# EAGLE design mother_card_13 (EAGLE 8.3.2)
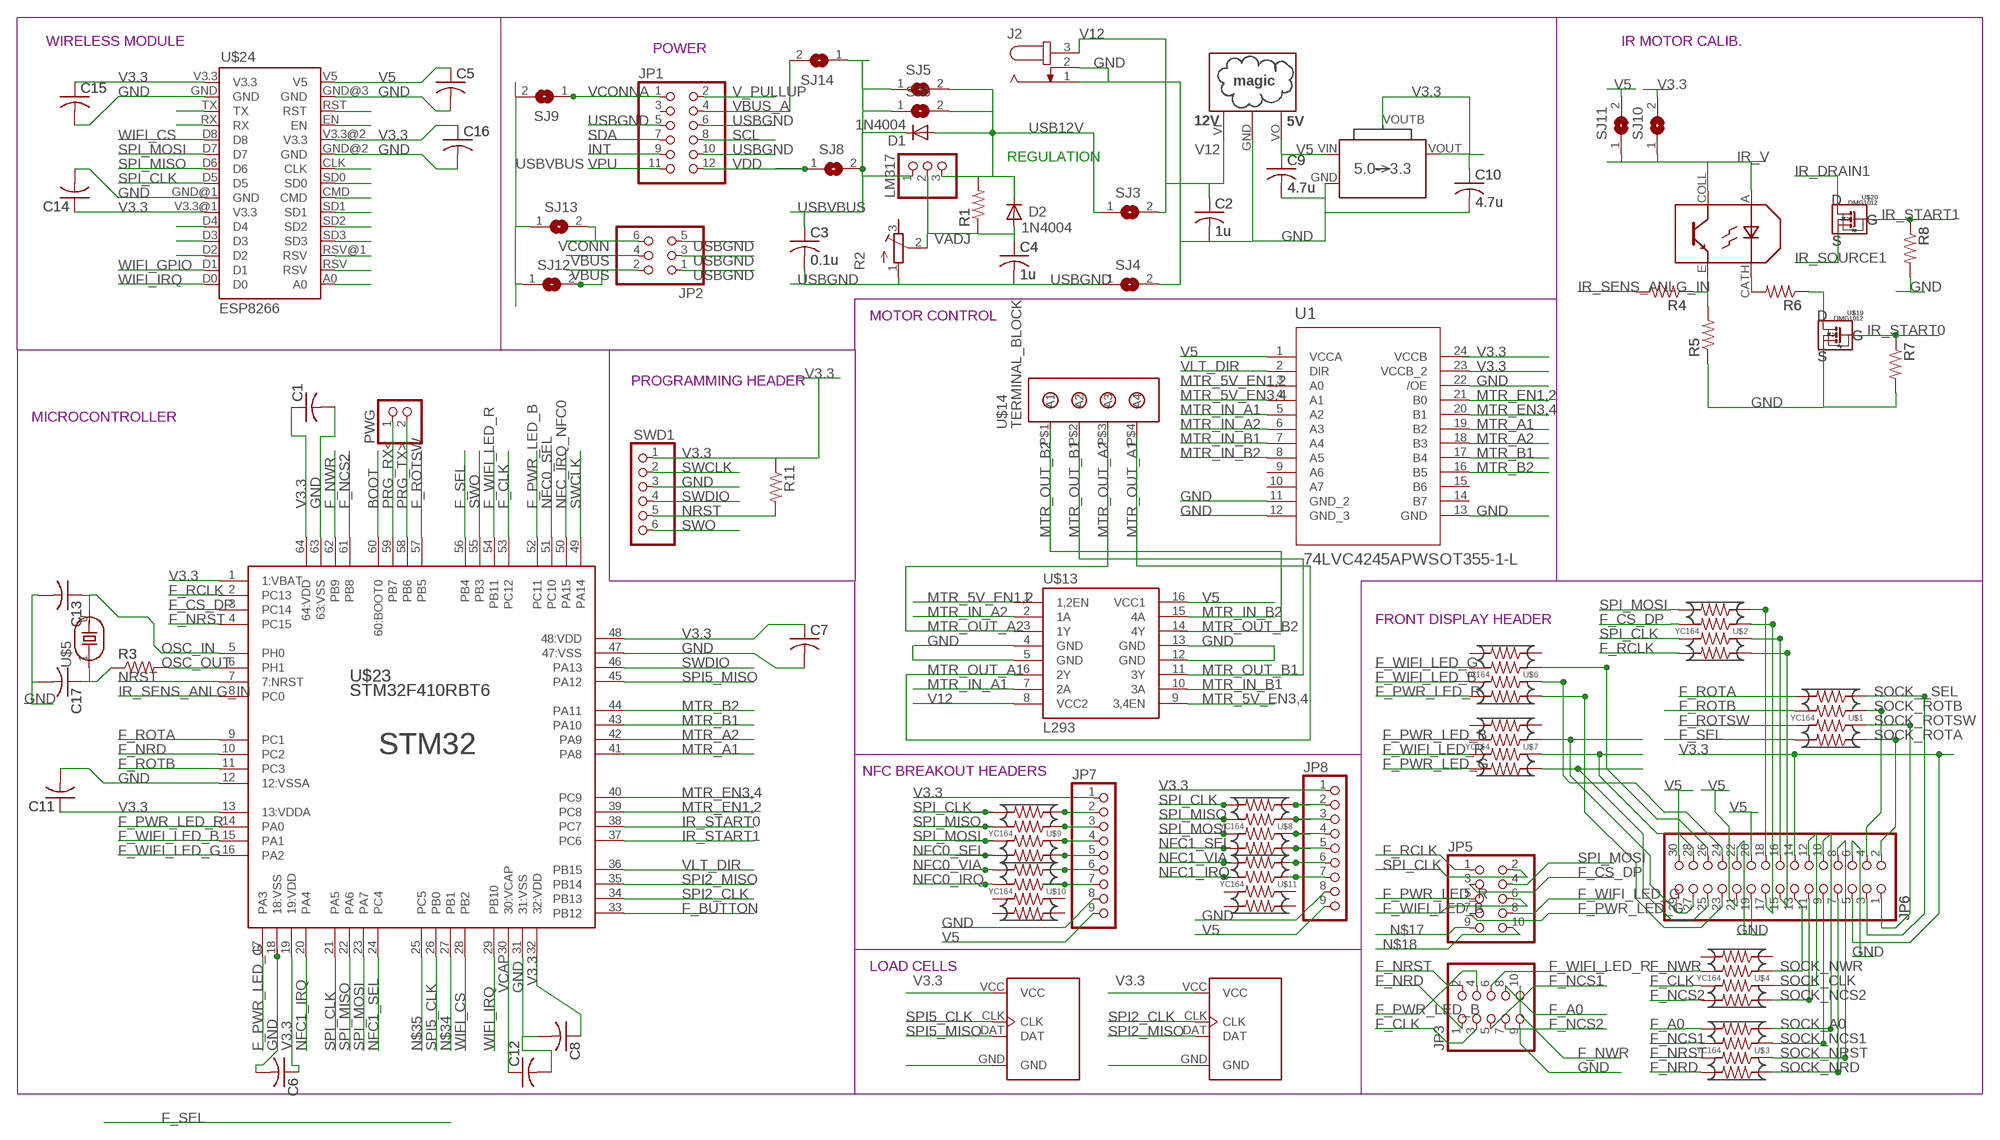
[diagram p0: schematic, sheet 1]

## Parts
C1  C-USC0805  [C0805]
C2  1u  C-USC0805  [C0805]
C3  0.1u  C-USC0805  [C0805]
C4  1u  C-USC0805  [C0805]
C5  C-USC0805  [C0805]
C6  C-USC0805  [C0805]
C7  C-USC0805  [C0805]
C8  C-USC0805  [C0805]
C9  4.7u  C-USC0805  [C0805]
C10  4.7u  C-USC0805  [C0805]
C11  C-USC0805  [C0805]
C12  C-USC0805  [C0805]
C13  C-USC0603  [C0603]
C14  C-USC0805  [C0805]
C15  C-USC0805  [C0805]
C16  C-USC0805  [C0805]
C17  C-USC0603  [C0603]
D1  1N4004  [DO41-10]
D2  1N4004  [DO41-10]
J2  JACK-PLUG0  [SPC4077]
JP1  PINHD-2X6  [2X06]
JP2  PINHD-2X3  [2X03]
JP3  PINHD-2X5  [2X05]
JP5  PINHD-2X5  [2X05]
JP6  PINHD-2X15/SOCK  [2X15/SOCK]
JP7  PINHD-1X9/90  [1X09/90]
JP8  PINHD-1X9/90  [1X09/90]
LM317  PINHD-1X3  [1X03]
PWG  PINHD-1X2  [1X02]
R1  R-US_R0805  [R0805]
R2  R-TRIMM64W  [RTRIM64W]
R3  R-US_R0805  [R0805]
R4  R-US_R0805  [R0805]
R5  R-US_R0805  [R0805]
R6  R-US_R0805  [R0805]
R7  R-US_R0805  [R0805]
R8  R-US_R0805  [R0805]
R11  R-US_R0805  [R0805]
SJ3  SJ  [SJ]
SJ4  SJ  [SJ]
SJ5  SJ  [SJ]
SJ6  SJ  [SJ]
SJ8  SJ  [SJ]
SJ9  SJ  [SJ]
SJ10  SJ  [SJ]
SJ11  SJ  [SJ]
SJ12  SJ  [SJ]
SJ13  SJ  [SJ]
SJ14  SJ  [SJ]
SWD1  PINHD-1X6  [1X06]
U1  74LVC4245APWSOT355-1-L  [SOT355-1-L]
U$1  YC164  [YC164]
U$2  YC164  [YC164]
U$3  YC164  [YC164]
U$4  YC164  [YC164]
U$5  HC-49S_9B  [HC-49S_9B]
U$6  YC164  [YC164]
U$7  YC164  [YC164]
U$8  YC164  [YC164]
U$9  YC164  [YC164]
U$10  YC164  [YC164]
U$11  YC164  [YC164]
U$13  L293  [DIL16]
U$14  TERMINAL_BLOCK  [1X4/BLOCK]
U$15  AP2114H  [AP2114H]
U$16  OKI-78SR-W36  [SIP3]
U$18  TCRT5000  [TCRT5000]
U$19  DMG1012  [SOT323]
U$20  DMG1012  [SOT323]
U$21  HX711  [HX711]
U$22  HX711  [HX711]
U$23  STM32F410RBT6  [QFP50P1200X1200X160-64N]
U$24  ESP8266  [ESP8266]

## Nets
BOOT: U$23.60(60:BOOT0)
F_A0: JP3.8 U$3.P$4
F_BUTTON: U$23.33(PB12)
F_CLK: JP3.3 U$4.P$2 U$23.53(PC12)
F_CS_DP: JP5.3 U$2.P$3 U$23.3(PC14)
F_NCS1: JP3.5 U$3.P$3
F_NCS2: JP3.7 U$4.P$1 U$23.61(PB8)
F_NRD: JP3.1 U$3.P$1 U$23.10(PC2)
F_NRST: JP3.2 U$3.P$2 U$23.4(PC15)
F_NWR: JP3.10 U$4.P$3 U$23.62(PB9)
F_PWR_LED_B: JP3.4 U$7.P$3 U$23.52(PC11)
F_PWR_LED_G: JP5.7 U$7.P$1 U$23.17(PA3)
F_PWR_LED_R: JP5.5 U$6.P$1 U$23.14(PA0)
F_RCLK: JP5.1 U$2.P$1 U$23.2(PC13)
F_ROTA: U$1.P$4 U$23.9(PC1)
F_ROTB: U$1.P$3 U$23.11(PC3)
F_ROTSW: U$1.P$2 U$23.57(PB5)
F_SEL: U$1.P$1 U$23.56(PB4)
F_WIFI_LED_B: JP5.6 U$6.P$2 U$23.15(PA1)
F_WIFI_LED_G: JP5.8 U$6.P$3 U$23.16(PA2)
F_WIFI_LED_R: JP3.6 U$7.P$2 U$23.54(PB11)
GND: C1.2 C2.2 C5.2 C6.2 C7.2 C8.2 C9.2 C10.2 C11.2 C12.2 C13.2 C14.2 C15.2 C16.2 C17.2 J2.1 J2.2 JP3.9 JP6.6 JP6.19 JP6.22 JP7.8 JP8.8 R5.1 R7.2 R8.2 SJ4.2 SWD1.3 U1.11(GND_2) U1.12(GND_3) U1.13(GND) U1.22(/OE) U$13.4(GND) U$13.5(GND) U$13.12(GND) U$13.13(GND) U$15.GND U$16.GND U$19.S U$21.GND U$22.GND U$23.12(12:VSSA) U$23.18(18:VSS) U$23.31(31:VSS) U$23.47(47:VSS) U$23.63(63:VSS) U$24.GND U$24.GND@1(GND) U$24.GND@2(GND) U$24.GND@3(GND)
INT: JP1.9
IR_DRAIN1: U$20.D
IR_SENS_ANLG_IN: R4.2 U$23.8(PC0)
IR_SOURCE1: U$20.S
IR_START0: R7.1 U$19.G U$23.38(PC7)
IR_START1: R8.1 U$20.G U$23.37(PC6)
IR_V: SJ10.1 SJ11.1 U$18.A U$18.COLL
MTR_5V_EN1,2: U1.3(A0) U$13.1(1,2EN)
MTR_5V_EN3,4: U1.4(A1) U$13.9(3,4EN)
MTR_A1: U1.19(B2) U$23.41(PA8)
MTR_A2: U1.18(B3) U$23.42(PA9)
MTR_B1: U1.17(B4) U$23.43(PA10)
MTR_B2: U1.16(B5) U$23.44(PA11)
MTR_EN1,2: U1.21(B0) U$23.39(PC8)
MTR_EN3,4: U1.20(B1) U$23.40(PC9)
MTR_IN_A1: U1.5(A2) U$13.7(2A)
MTR_IN_A2: U1.6(A3) U$13.2(1A)
MTR_IN_B1: U1.7(A4) U$13.10(3A)
MTR_IN_B2: U1.8(A5) U$13.15(4A)
MTR_OUT_A1: U$13.6(2Y) U$14.P$4(A4)
MTR_OUT_A2: U$13.3(1Y) U$14.P$3(A3)
MTR_OUT_B1: U$13.11(3Y) U$14.P$2(A2)
MTR_OUT_B2: U$13.14(4Y) U$14.P$1(A1)
N$1: U$24.A0
N$2: JP7.6 U$10.P$44
N$4: JP8.6 U$11.P$44
N$5: R6.2 U$18.CATH
N$8: R3.2 U$23.6(PH1)
N$9: U$24.RSV
N$10: R6.1 U$19.D
N$13: U$24.RSV@1(RSV)
N$14: U$24.SD3
N$15: U$24.SD2
N$16: U$24.SD1
N$17: JP5.9
N$18: JP5.10
N$23: U$24.CMD
N$24: U$24.SD0
N$25: U$24.CLK
N$26: U$24.D2
N$27: U$24.D3
N$28: U$24.D4
N$29: U$24.RX
N$30: U$24.TX
N$31: U$24.EN
N$32: U$24.RST
N$33: JP8.2 U$8.P$44
N$34: U$23.27(PB1)
N$35: U$23.25(PC5)
N$36: JP8.3 U$8.P$33
N$37: JP8.4 U$8.P$22
N$38: JP8.5 U$8.P$11
N$39: JP8.7 U$11.P$33
N$40: JP7.5 U$9.P$11
N$41: JP7.4 U$9.P$22
N$42: JP7.3 U$9.P$33
N$43: JP7.2 U$9.P$44
N$44: JP7.7 U$10.P$33
N$45: R4.1 R5.2 U$18.E
NFC0_IRQ: U$10.P$3
NFC0_SEL: U$9.P$1 U$23.51(PC10)
NFC0_VIA: U$10.P$4
NFC1_IRQ: U$11.P$3 U$23.20(PA4)
NFC1_SEL: U$8.P$1 U$23.24(PC4)
NFC1_VIA: U$11.P$4
NFC_IRQ_NFC0: U$23.50(PA15)
NRST: R11.2 SWD1.5 U$23.7(7:NRST)
OSC_IN: C13.1 U$5.0 U$23.5(PH0)
OSC_OUT: C17.1 R3.1 U$5.1
PRG_RX<: PWG.1 U$23.59(PB7)
PRG_TX>: PWG.2 U$23.58(PB6)
SCL: JP1.8
SDA: JP1.7
SOCK__CS_DP: JP6.17 U$2.P$33
SOCK__RCLK: JP6.15 U$2.P$11
SOCK__SEL: JP6.3 U$1.P$44
SOCK_A0: JP6.10 U$3.P$44
SOCK_CLK: JP6.12 U$4.P$22
SOCK_NCS1: JP6.9 U$3.P$33
SOCK_NCS2: JP6.11 U$4.P$11
SOCK_NRD: JP6.7 U$3.P$11
SOCK_NRST: JP6.8 U$3.P$22
SOCK_NWR: JP6.13 U$4.P$33
SOCK_PWR_LED_B: JP6.27 U$7.P$33
SOCK_PWR_LED_G: JP6.25 U$7.P$11
SOCK_PWR_LED_R: JP6.23 U$6.P$11
SOCK_ROTA: JP6.2 U$1.P$11
SOCK_ROTB: JP6.4 U$1.P$33
SOCK_ROTSW: JP6.1 U$1.P$22
SOCK_SPI_CLK: JP6.16 U$2.P$22
SOCK_SPI_MOSI: JP6.18 U$2.P$44
SOCK_WIFI_LED_B: JP6.24 U$6.P$22
SOCK_WIFI_LED_G: JP6.26 U$6.P$33
SOCK_WIFI_LED_R: JP6.28 U$7.P$22
SPI2_CLK: U$22.CLK U$23.34(PB13)
SPI2_MISO: U$22.DAT U$23.35(PB14)
SPI5_CLK: U$21.CLK U$23.26(PB0)
SPI5_MISO: U$21.DAT U$23.45(PA12)
SPI_CLK: JP5.2 U$2.P$2 U$8.P$4 U$9.P$4 U$23.21(PA5) U$24.D5
SPI_MISO: U$8.P$3 U$9.P$3 U$23.22(PA6) U$24.D6
SPI_MOSI: JP5.4 U$2.P$4 U$8.P$2 U$9.P$2 U$23.23(PA7) U$24.D7
SWCLK: SWD1.2 U$23.49(PA14)
SWDIO: SWD1.4 U$23.46(PA13)
SWO: SWD1.6 U$23.55(PB3)
USB12V: D1.A D2.C LM317.3 R1.2 SJ3.1 SJ5.2 SJ6.2
USBGND: C3.2 C4.2 JP1.5 JP1.6 JP1.10 JP2.1 JP2.3 JP2.5 R2.1(A) SJ4.1
USBVBUS: C3.1 D1.C LM317.1 SJ5.1 SJ6.1 SJ8.2 SJ9.2 SJ12.1 SJ13.1 SJ14.1
V3.3: C1.1 C6.1 C7.1 C8.1 C10.1 C11.1 C14.1 C15.1 C16.1 JP6.5 JP6.14 JP7.1 JP8.1 R11.1 SJ10.2 SWD1.1 U1.23(VCCB_2) U1.24(VCCB) U$15.VOUT(VO) U$15.VOUTB(BODY) U$21.VCC U$22.VCC U$23.1(1:VBAT) U$23.13(13:VDDA) U$23.19(19:VDD) U$23.32(32:VDD) U$23.48(48:VDD) U$23.64(64:VDD) U$24.V3.3 U$24.V3.3@1(V3.3) U$24.V3.3@2(V3.3)
V5: C5.1 C9.1 JP6.20 JP6.21 JP6.30 JP7.9 JP8.9 SJ11.2 U1.1(VCCA) U$13.16(VCC1) U$15.VIN(VI) U$16.VO U$24.V5
V12: C2.1 J2.3 SJ3.2 U$13.8(VCC2) U$16.VI
V_PULLUP: JP1.2
VADJ: C4.1 D2.A LM317.2 R1.1 R2.2(S)
VBUS: JP2.2 JP2.4 SJ12.2
VBUS_A: JP1.4 SJ14.2
VCAP: C12.1 U$23.30(30:VCAP)
VCONN: JP2.6 SJ13.2
VCONNA: JP1.1 SJ9.1
VDD: JP1.12 SJ8.1
VLT_DIR: U1.2(DIR) U$23.36(PB15)
VPU: JP1.11
WIFI_CS: U$23.28(PB2) U$24.D8
WIFI_GPIO: U$24.D1
WIFI_IRQ: U$23.29(PB10) U$24.D0
Unconnected: JP1.3 JP6.29 R2.3(E) U1.9(A6) U1.10(A7) U1.14(B7) U1.15(B6) U$4.P$4 U$4.P$44 U$6.P$4 U$6.P$44 U$7.P$4 U$7.P$44 U$10.P$1 U$10.P$2 U$10.P$11 U$10.P$22 U$11.P$1 U$11.P$2 U$11.P$11 U$11.P$22

## Notes on the sheet
- WIRELESS MODULE | IR MOTOR CALIB.
- POWER
- REGULATION
- MOTOR CONTROL
- PROGRAMMING HEADER
- MICROCONTROLLER
- FRONT DISPLAY HEADER
- NFC BREAKOUT HEADERS
- LOAD CELLS

## Library data of the parts
C1-C17 = seniorDesign:C-US: CAPACITOR, American symbol
D1 D2 = diode:1N4004: DIODE general purpose rectifier, 1 A
J2 = con-jack:JACK-PLUG: DC POWER JACK Power Jack, DC, Right Angle, Through Hole, Rated 5A at 16VDC, PC Terminals Distributor: Farnell (www.Farnell.de) Drawing: 84N1161.pdf / 84N1162.pdf Manufacturer: SPC Technology (www.spctechnology.com) Type: SPC4077 / SPC 4078; OC_FARNELL: unknown; OC_NEWARK: unknown
JP1 = pinhead:PINHD-2X6: PIN HEADER
JP2 = pinhead:PINHD-2X3: PIN HEADER
JP3 JP5 = pinhead:PINHD-2X5: PIN HEADER
JP6 = seniorDesign:PINHD-2X15: PIN HEADER, socket for parallel cable, IDC connector, On Shore Technology Inc.
JP7 JP8 = pinhead:PINHD-1X9: PIN HEADER
LM317 = pinhead:PINHD-1X3: PIN HEADER
PWG = pinhead:PINHD-1X2: PIN HEADER
R1 R3-R8 = seniorDesign:R-US_: RESISTOR, American symbol
R2 = rcl:R-TRIMM: Trimm resistor
R11 = resistor:R-US_: RESISTOR, American symbol
SJ3-SJ6 SJ8-SJ14 = jumper:SJ: SMD solder JUMPER
SWD1 = pinhead:PINHD-1X6: PIN HEADER
U1 = seniorDesign:74LVC4245APW: Level Translator input board; MANUFACTURER_PART_NUMBER: 74LVC4245APW; VENDOR: NXP
U$1-U$4 U$6-U$11 = seniorDesign:YC164: Yageo Resistor Array motherboard serial resistance for cables headed offboard
U$5 = seniorDesign:HC-49S_9B: TXC CORPORATION 9B-25.000MBBK-B motherboard stm32 HSE external clock reference http://www.txccorp.com/download/products/quartz_crystals/2015TXC_9B_33.pdf
U$13 = seniorDesign:L293: L293 Stepper Motor Driver
U$14 = seniorDesign:TERMINAL_BLOCK: Terminal Block for stepper motor connections
U$15 = seniorDesign:AP2114: AP2114H-3.3TRG1DICT-ND 5V LDO, main 5V line, motherboard https://www.diodes.com/assets/Datasheets/AP2114.pdf
U$16 = seniorDesign:OKI-78SR-W36
U$18 = seniorDesign:TCRT5000: Vishay Semiconductor Opto Division TCRT5000 mother board cover repositioning http://www.vishay.com/docs/83760/tcrt5000.pdf
U$19 U$20 = seniorDesign:DMG1012: DMG1012UW-7DICT-ND https://www.diodes.com/assets/Datasheets/ds31859.pdf Vt ~= 1.25V, IDS ~= 0.900 A, [VGS = (3.3 - 0.7)V, VDS = 0V]
U$21 U$22 = seniorDesign:HX711: old green circuit board rendition of HX711 load amplifier
U$23 = seniorDesign:STM32F410RBT6: STMicroelectronics STM32F410RBT6 main microcontroller, motherboard http://www.st.com/.../content/translations/en.DM00214043.pdf <http://www.st.com/content/ccc/resource/technical/document/datasheet/6e/f3/b0/1b/05/eb/49/fe/DM00214043.pdf/files/DM00214043.pdf/jcr:content/translations/en.DM00214043.pdf>
U$24 = seniorDesign:ESP8266: ESP8266 Wifi Module Breakout

## Board
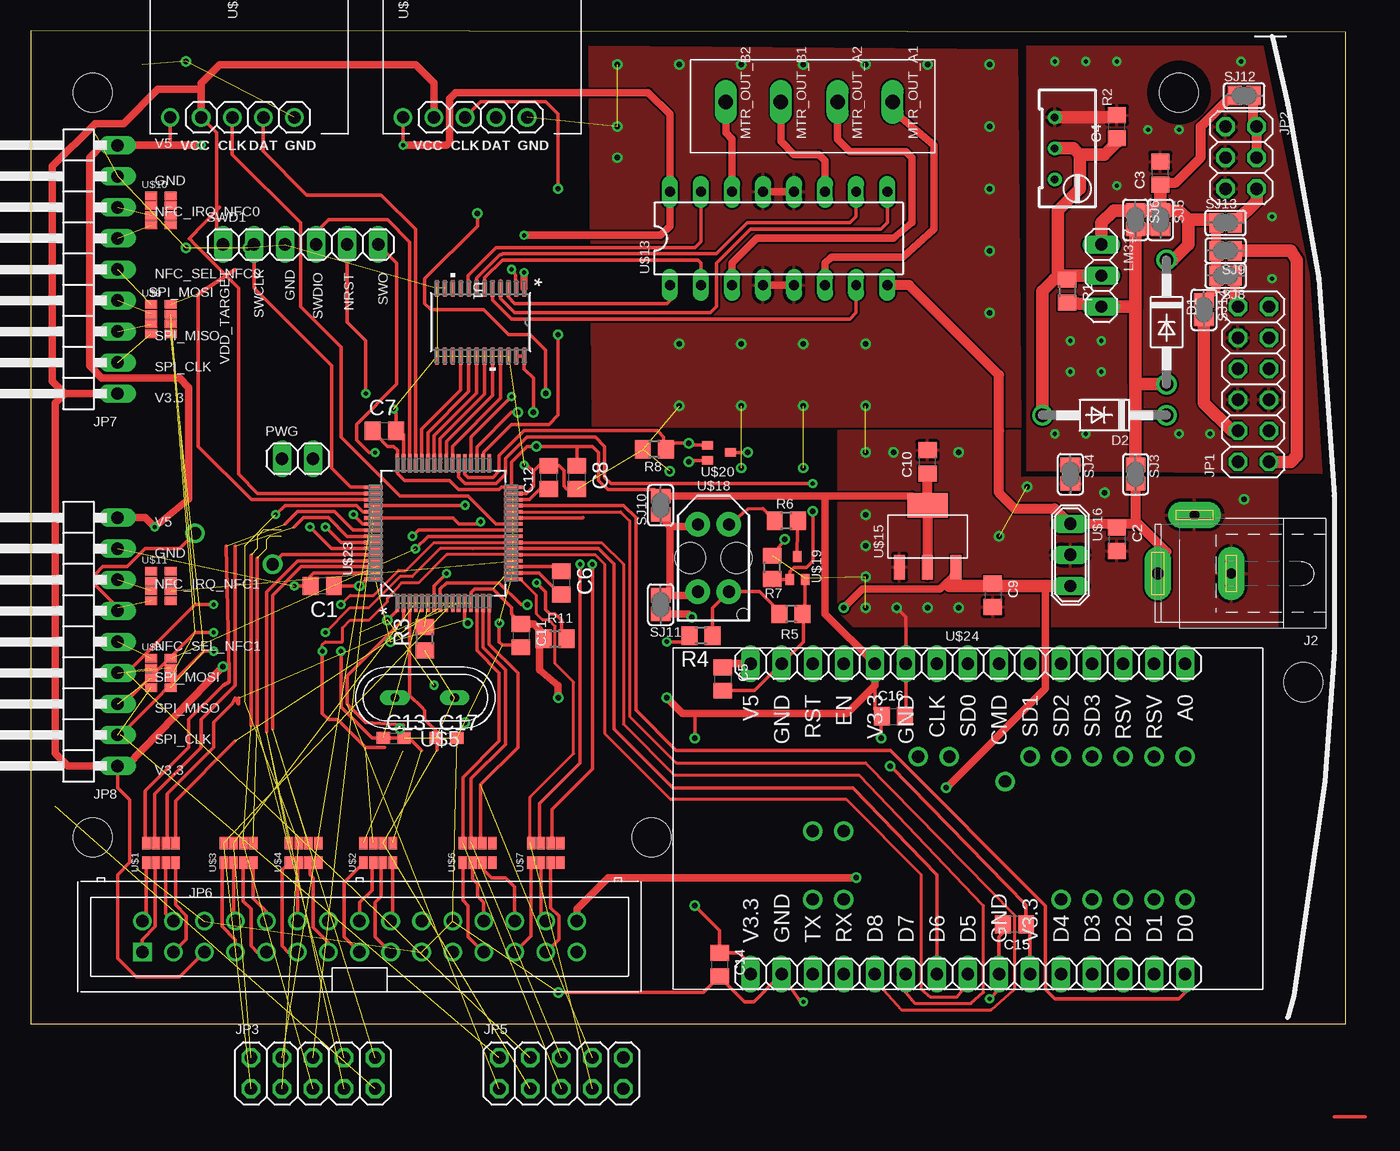
[diagram p1: board, top side]
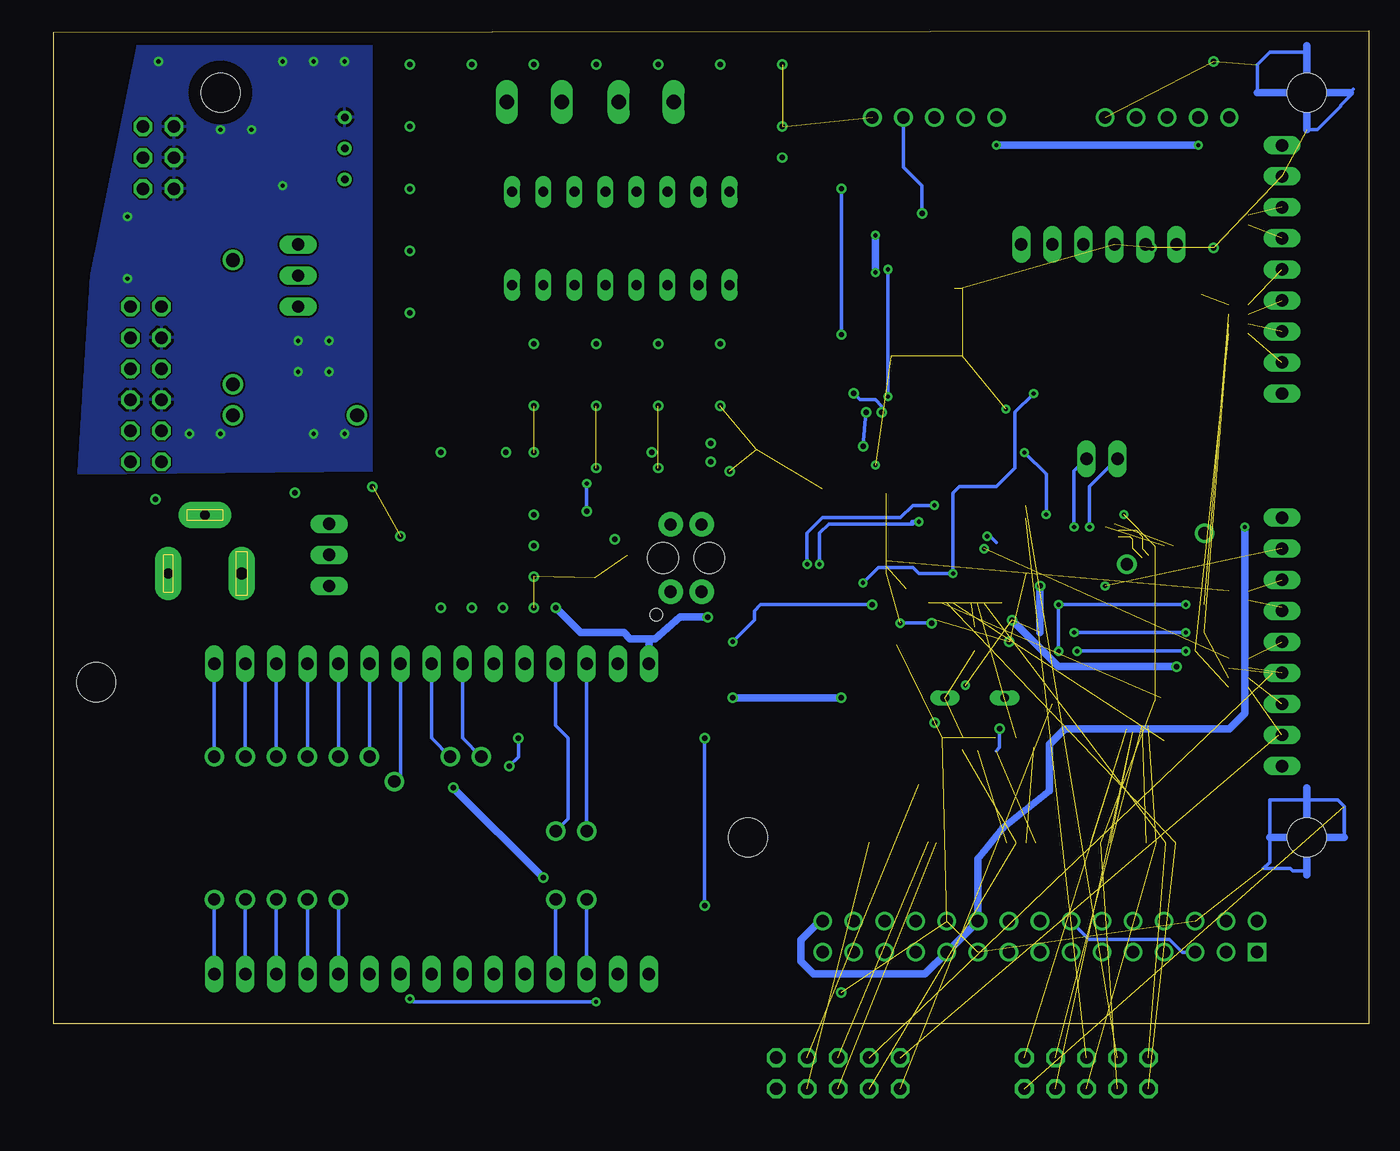
[diagram p2: board, bottom side, seen from below]

Size 107.62 x 81.27 mm. Coordinates in mm from the lower left corner, seen from the top.
Outline: 0,0 107.62,0 107.62,81.14 0,81.27 0,0
Copper layers (1*16): Top 0.035mm / dielectric 1.5mm / Bottom 0.035mm
Design rules "default": minimum track width 6mil, minimum drill 0.35mm, track to track 6mil, track to pad 6mil, pad to pad 6mil, via to via 6mil, smd to smd 6mil, copper to edge 40mil, drill to drill 6mil, minimum pad ring 10mil, minimum via ring 8mil, stop-mask expansion 4mil, vias tented up to drill 0mil, thermal gap 10mil
Holes 3.17 mm at 5.08,76.2 5.08,15.24 104.14,27.94 93.98,76.2 50.8,15.24

### Footprints (pad centres in the part's own frame; a part is rotated, then mirrored left to right if it is on the bottom)
C0805 = smd 1.3 x 1.5: 1 -0.95,0; 2 0.95,0
C0603 = smd 1.1 x 1: 1 -0.85,0; 2 0.85,0
DO41-10 = drill 1.118: A 5.08,0; C -5.08,0
SPC4077 = drill 0.8 pad 2.184 long: 1 -3,0; 2 0,-4.8 | drill 1 pad 2.184 long: 3 3,0
2X06 = drill 1.016 octagon: 1 -6.35,-1.27; 2 -6.35,1.27; 3 -3.81,-1.27; 4 -3.81,1.27; 5 -1.27,-1.27; 6 -1.27,1.27; 7 1.27,-1.27; 8 1.27,1.27; 9 3.81,-1.27; 10 3.81,1.27; 11 6.35,-1.27; 12 6.35,1.27
2X03 = drill 1.016 octagon: 1 -2.54,-1.27; 2 -2.54,1.27; 3 0,-1.27; 4 0,1.27; 5 2.54,-1.27; 6 2.54,1.27
2X05 = drill 1.016 octagon: 1 -5.08,-1.27; 2 -5.08,1.27; 3 -2.54,-1.27; 4 -2.54,1.27; 5 0,-1.27; 6 0,1.27; 7 2.54,-1.27; 8 2.54,1.27; 9 5.08,-1.27; 10 5.08,1.27
2X15/SOCK = drill 1.016 square: 1 -17.78,-1.27 | drill 1.016: 2 -17.78,1.27; 3 -15.24,-1.27; 4 -15.24,1.27; 5 -12.7,-1.27; 6 -12.7,1.27; 7 -10.16,-1.27; 8 -10.16,1.27; 9 -7.62,-1.27; 10 -7.62,1.27; 11 -5.08,-1.27; 12 -5.08,1.27; 13 -2.54,-1.27; 14 -2.54,1.27; 15 0,-1.27; 16 0,1.27; 17 2.54,-1.27; 18 2.54,1.27; 19 5.08,-1.27; 20 5.08,1.27; 21 7.62,-1.27; 22 7.62,1.27; 23 10.16,-1.27; 24 10.16,1.27; 25 12.7,-1.27; 26 12.7,1.27; 27 15.24,-1.27; 28 15.24,1.27; 29 17.78,-1.27; 30 17.78,1.27
1X09/90 = drill 1.016 long: 1 -10.16,-3.81; 2 -7.62,-3.81; 3 -5.08,-3.81; 4 -2.54,-3.81; 5 0,-3.81; 6 2.54,-3.81; 7 5.08,-3.81; 8 7.62,-3.81; 9 10.16,-3.81
1X03 = drill 1.016 long: 1 -2.54,0; 2 0,0; 3 2.54,0
1X02 = drill 1.016 long: 1 -1.27,0; 2 1.27,0
R0805 = smd 1.3 x 1.5: 1 -0.95,0; 2 0.95,0
RTRIM64W = drill 0.61: 1 1.27,-2.54; 2 1.27,0; 3 1.27,2.54
SJ = smd 1.168 x 1.6: 1 -0.762,0; 2 0.762,0
1X06 = drill 1.016 long: 1 -6.35,0; 2 -3.81,0; 3 -1.27,0; 4 1.27,0; 5 3.81,0; 6 6.35,0
SOT355-1-L = smd 1.372 x 0.305: 1 -2.769,3.575; 2 -2.769,2.925; 3 -2.769,2.275; 4 -2.769,1.625; 5 -2.769,0.975; 6 -2.769,0.325; 7 -2.769,-0.325; 8 -2.769,-0.975; 9 -2.769,-1.625; 10 -2.769,-2.275; 11 -2.769,-2.925; 12 -2.769,-3.575; 13 2.769,-3.575; 14 2.769,-2.925; 15 2.769,-2.275; 16 2.769,-1.625; 17 2.769,-0.975; 18 2.769,-0.325; 19 2.769,0.325; 20 2.769,0.975; 21 2.769,1.625; 22 2.769,2.275; 23 2.769,2.925; 24 2.769,3.575
YC164 = smd 0.7 x 1: P$1 -1.2,0.8; P$2 -0.4,0.8; P$3 0.4,0.8; P$4 1.2,0.8; P$11 -1.2,-0.8; P$22 -0.4,-0.8; P$33 0.4,-0.8; P$44 1.2,-0.8
HC-49S_9B = drill 0.7 long: 0 -2.44,0; 1 2.44,0
DIL16 = drill 0.813 long: 1 -8.89,-3.81; 2 -6.35,-3.81; 3 -3.81,-3.81; 4 -1.27,-3.81; 5 1.27,-3.81; 6 3.81,-3.81; 7 6.35,-3.81; 8 8.89,-3.81; 9 8.89,3.81; 10 6.35,3.81; 11 3.81,3.81; 12 1.27,3.81; 13 -1.27,3.81; 14 -3.81,3.81; 15 -6.35,3.81; 16 -8.89,3.81
1X4/BLOCK = drill 1.2 long: P$1 0,0; P$2 4.5,0; P$3 9.15,0; P$4 13.65,0
AP2114H = smd 0.9 x 2: GND -2.3,-2.52; VIN 2.3,-2.52; VOUT 0,-2.52 | smd 3.3 x 2: VOUTB 0,2.53
SIP3 = drill 1.016 long: GND 0,0; VI -2.54,0; VO 2.54,0
TCRT5000 = drill 1 pad 2: A 2.75,1.27; CATH 2.75,-1.27; COLL -2.75,1.27; E -2.75,-1.27 | hole 2.5: 0,1.9; 0,-1.9 | hole 1: -4.65,-2.45
SOT323 = smd 0.7 x 0.9: D 0,0.9; G -0.6,-1; S 0.65,-1
HX711 = drill 1.016: CLK -2.54,1.52; DAT -2.54,4.06; GND -2.54,6.6; VCC -2.54,-1.02
QFP50P1200X1200X160-64N = smd 1.5 x 0.3: 1 -5.715,3.759; 2 -5.715,3.251; 3 -5.715,2.743; 4 -5.715,2.261; 5 -5.715,1.753; 6 -5.715,1.245; 7 -5.715,0.762; 8 -5.715,0.254; 9 -5.715,-0.254; 10 -5.715,-0.762; 11 -5.715,-1.245; 12 -5.715,-1.753; 13 -5.715,-2.261; 14 -5.715,-2.743; 15 -5.715,-3.251; 16 -5.715,-3.759; 33 5.715,-3.759; 34 5.715,-3.251; 35 5.715,-2.743; 36 5.715,-2.261; 37 5.715,-1.753; 38 5.715,-1.245; 39 5.715,-0.762; 40 5.715,-0.254; 41 5.715,0.254; 42 5.715,0.762; 43 5.715,1.245; 44 5.715,1.753; 45 5.715,2.261; 46 5.715,2.743; 47 5.715,3.251; 48 5.715,3.759 | smd 0.3 x 1.5: 17 -3.759,-5.715; 18 -3.251,-5.715; 19 -2.743,-5.715; 20 -2.261,-5.715; 21 -1.753,-5.715; 22 -1.245,-5.715; 23 -0.762,-5.715; 24 -0.254,-5.715; 25 0.254,-5.715; 26 0.762,-5.715; 27 1.245,-5.715; 28 1.753,-5.715; 29 2.261,-5.715; 30 2.743,-5.715; 31 3.251,-5.715; 32 3.759,-5.715; 49 3.759,5.715; 50 3.251,5.715; 51 2.743,5.715; 52 2.261,5.715; 53 1.753,5.715; 54 1.245,5.715; 55 0.762,5.715; 56 0.254,5.715; 57 -0.254,5.715; 58 -0.762,5.715; 59 -1.245,5.715; 60 -1.753,5.715; 61 -2.261,5.715; 62 -2.743,5.715; 63 -3.251,5.715; 64 -3.759,5.715
ESP8266 = drill 1.016 long: A0 19.05,0; CLK -1.27,0; CMD 3.81,0; D0 19.05,-25.4; D1 16.51,-25.4; D2 13.97,-25.4; D3 11.43,-25.4; D4 8.89,-25.4; D5 1.27,-25.4; D6 -1.27,-25.4; D7 -3.81,-25.4; D8 -6.35,-25.4; EN -8.89,0; GND -13.97,-25.4; GND@1 3.81,-25.4; GND@2 -3.81,0; GND@3 -13.97,0; RST -11.43,0; RSV 16.51,0; RSV@1 13.97,0; RX -8.89,-25.4; SD0 1.27,0; SD1 6.35,0; SD2 8.89,0; SD3 11.43,0; TX -11.43,-25.4; V3.3 -16.51,-25.4; V3.3@1 6.35,-25.4; V3.3@2 -6.35,0; V5 -16.51,0

### Placement (x,y rotation side)
C1  23.88,35.81 180 top
C2  88.9,39.62 270 top
C3  92.46,69.6 90 top
C4  88.9,73.41 90 top
C5  56.64,28.19 270 top
C6  43.43,36.07 270 top
C7  28.96,48.51 0 top
C8  44.7,44.7 270 top
C9  78.74,35.05 270 top
C10  73.41,45.97 90 top
C11  40.13,31.75 270 top
C12  42.42,44.7 90 top
C13  29.72,23.37 0 top
C14  56.39,4.83 270 top
C15  80.52,8.13 180 top
C16  70.61,25.15 0 top
C17  34.04,23.37 0 top
D1  92.96,57.4 270 top
D2  87.88,49.78 180 top
J2  95.25,36.83 180 top
JP1  100.08,52.32 90 top
JP2  99.06,70.87 270 top
JP3  23.11,-4.06 0 top
JP5  43.43,-4.06 0 top
JP6  26.92,7.11 0 top
JP7  3.3,61.72 90 top
JP8  3.3,31.24 90 top
LM317  87.63,61.21 270 top
PWG  21.84,46.23 0 top
R1  84.84,59.94 270 top
R2  85.09,71.63 180 top
R3  32.26,31.5 90 top
R4  54.86,31.75 180 top
R5  62.23,33.53 180 top
R6  61.85,41.15 180 top
R7  60.71,37.34 90 top
R8  51.05,46.99 180 top
R11  42.93,31.5 0 top
SJ3  90.42,44.96 270 top
SJ4  85.09,44.96 270 top
SJ5  92.46,65.79 270 top
SJ6  90.42,65.79 270 top
SJ8  97.79,61.21 180 top
SJ9  97.79,63.25 180 top
SJ10  51.56,42.42 90 top
SJ11  51.56,34.29 270 top
SJ12  99.31,75.95 0 top
SJ13  97.79,65.53 0 top
SJ14  96.01,58.42 270 top
SWD1  22.1,63.75 0 top
U1  36.83,57.4 270 top
U$1  10.67,13.97 0 top
U$2  28.45,13.97 0 top
U$3  17.02,13.97 0 top
U$4  22.35,13.97 0 top
U$5  32.26,26.67 0 top
U$6  36.58,13.97 0 top
U$7  42.16,13.97 0 top
U$8  10.67,28.7 270 top
U$9  10.67,57.66 270 top
U$10  10.67,66.55 270 top
U$11  10.67,35.81 270 top
U$13  61.21,64.26 0 top
U$14  56.9,75.44 0 top
U$15  73.41,39.88 0 top
U$16  85.09,38.35 270 top
U$18  55.88,38.1 90 top
U$19  62.74,37.34 0 top
U$20  56.39,46.74 270 top
U$21  14.99,71.63 270 top
U$22  34.04,71.63 270 top
U$23  33.78,40.13 90 top
U$24  75.44,29.46 0 top

### Tracks (layer width: path | path; a pad name or v marks a point on that pad's centre or on a via)
BOOT  (via drill 1 pad 1.6)
  Top 0.305: U$23.60 20.6,38.38 v19.81,37.59
F_A0  (6 unrouted)
  Top 0.305: 18.54,24.38 18.54,38.12
F_CLK  (via drill 0.35)  (4 unrouted)
  Top 0.305: U$23.53 27.2,41.89 26.67,42.42 20.83,42.42 v20.07,41.66
F_CS_DP  (2 unrouted)
  Top 0.305: U$23.3 31.04,26.87 32.03,25.88 32.03,25.86 32.26,25.63 32.26,24.89 33.27,23.88 33.27,22.4
F_NCS1  (6 unrouted)
  Top 0.305: 18.03,38.35 18.03,24.38
F_NCS2  (2 unrouted)
  Top 0.305: U$23.61 21.87,37.87 19.3,35.31 19.3,23.88
F_NRD  (2 unrouted)
F_NRST  (2 unrouted)
F_NWR  (2 unrouted)
  Top 0.305: U$23.62 22.15,37.39 19.81,35.05 19.81,24.13
F_PWR_LED_B  (via drill 0.35)  (1 unrouted)
  Top 0.305: U$23.52 35.33,42.39 v35.56,42.42 | v45.97,37.59 45.97,36.83 45.97,35.81 | 45.97,35.81 45.97,35.56 | 45.97,35.81 45.97,35.05 45.97,20.83 42.67,17.53 42.67,14.88 U$7.P$3
  Bottom 0.305: v35.56,42.42 37.34,42.42 38.35,41.4 44.7,41.4 45.97,40.13 v45.97,37.59
F_PWR_LED_G  (1 unrouted)
  Top 0.254: U$23.17 39.55,36.32 40.13,36.32 41.4,35.05 41.4,33.53 41.91,33.02 42.42,33.02 42.93,32.51 42.93,29.46 44.45,27.94 44.45,22.1 40.89,18.54 40.89,14.84 U$7.P$1
F_PWR_LED_R  (1 unrouted)
  Top 0.305: U$23.14 36.52,30.53 38.35,28.7 38.35,23.11 35.38,20.14 U$6.P$1
F_RCLK  (via drill 0.45)  (2 unrouted)
  Top 0.305: v30.23,24.13 30.53,24.43 27.43,24.64 25.91,26.16 25.91,28.45 30.53,33.07 U$23.2
  Bottom 0.305: v30.23,24.13 30.23,22.59 30.5,22.31
F_ROTA  (1 unrouted)
  Top 0.305: U$1.P$4 11.87,18.22 16.76,23.11
F_ROTB  (1 unrouted)
  Top 0.305: U$1.P$3 11.18,14.88 11.18,18.8 14.99,22.61 14.99,24.64 16.51,26.16 16.76,26.67 17.02,26.16 17.02,26.67
F_ROTSW  (1 unrouted)
  Top 0.305: U$1.P$2 10.16,14.88 10.16,18.8 13.97,22.61 13.97,24.89 16.76,27.69 16.76,39.06 | U$23.57 25.91,39.88 24.38,41.4 22.35,41.4 21.59,40.64
F_SEL  (1 unrouted)
  Top 0.305: U$1.P$1 9.4,14.84 9.4,19.05 12.95,22.61 12.95,24.89 15.75,27.69 16.26,27.94 16.26,28.7 16.01,39.06 | U$23.56 26.42,40.39 24.89,41.91 21.84,41.91 20.83,40.89
F_WIFI_LED_B  (1 unrouted)
  Top 0.305: U$23.15 37.03,30.79 38.86,28.96 38.86,22.86 36.07,20.07 36.07,14.88 U$6.P$2
F_WIFI_LED_G  (1 unrouted)
  Top 0.305: U$23.16 37.54,31.04 39.88,28.7 39.88,22.61 36.83,19.56 36.83,15.4 36.83,14.91 U$6.P$3
F_WIFI_LED_R  (via drill 0.35)  (1 unrouted)
  Top 0.305: v36.83,41.07 36.65,40.89 35.05,40.89 34.57,41.38 U$23.54 | v44.96,37.59 44.96,21.34 41.66,18.03 41.66,14.88 U$7.P$2
  Bottom 0.305: v36.83,41.07 37.42,41.07 37.34,40.89 44.2,40.89 44.96,40.13 v44.96,37.59
GND  (via drill 0.35, 0.45)  (38 unrouted)
  Top 0.305: 63.39,36.46 U$19.S 63.39,33.6 63.25,33.46 | C5.2 59.25,27.24 U$24.GND@3 63.25,31.24 63.25,33.46 | U$23.12 35.54,33.02 v35.79,32.77 | R7.2 61.53,39.37 v61.72,39.62 | C16.2 71.63,25.21 U$24.GND@2 71.63,33.27 v70.87,34.04 | v43.18,2.54 55.05,2.54 C14.2 56.39,3.81 58.42,1.78 59.18,1.78 U$24.GND 62.99,1.78 v63.25,1.78 | C15.2 79.57,7.43 79.25,7.11 U$24.GND@1 79.25,2.79 v78.49,2.03 | C8.2 43.88,43.75 43.65,43.98 43.65,45.25 43.25,45.65 C12.2 42.35,45.72 41.66,45.72 41.15,45.21 | U$23.31 40.59,43.38 41.15,43.94 41.15,45.21 | 41.15,45.21 40.64,45.72 v40.39,45.72 | U$23.18 41.6,36.88 42.67,35.81 43.37,35.05 C6.2 | v38.35,32.77 38.35,31.24 38.61,30.99 40.07,30.99 C11.2 | U$23.47 30.53,48.21 30.23,48.51 C7.2 29.91,49.97 v29.72,50.29 | U$23.63 23.16,36.88 22.86,36.58 22.86,35.63 C1.2 v21.59,35.81 | 63.25,33.46 R5.1
  Top 0.61: U$13.4 U$13.5 | U$13.13 U$13.12
  Bottom 0.305: 5.08,12.48 5.08,12.19 5.37,12.48 6.22,12.48 6.44,12.7 8.64,12.7 8.13,13.21 8.13,15.24 8.13,18.29 2.54,18.29 2.03,17.78 2.03,15.24 | 9.14,76.2 9.14,78.49 8.13,79.5 5.08,79.5 | 1.52,75.95 2.32,75.15 2.32,75.06 4.23,73.15 5.08,73.15 | 1.52,76.2 1.27,76.45 | v78.49,2.03 78.23,1.78 v63.25,1.78 | v35.79,32.77 v38.35,32.77
  Bottom 0.61: 8.13,15.24 v5.08,15.24 | v5.08,15.24 5.08,12.19 | v5.08,15.24 2.03,15.24 | v5.08,15.24 5.08,19.3 | 9.14,76.2 v5.08,76.2 | v5.08,76.2 5.08,80.01 | v5.08,76.2 5.08,73.15 | v5.08,76.2 1.52,76.2
  other vias: 75.95,46.74 70.61,46.74 99.31,42.93 68.33,46.74 68.33,41.66 68.33,39.12 68.33,36.58 68.33,34.04 73.41,34.04 75.95,34.04 79.25,39.88 68.33,50.55 63.25,50.55 58.17,50.55 53.09,50.55 48.01,70.87 48.01,73.41 48.01,78.49 53.09,78.49 58.17,78.49 63.25,78.49 68.33,78.49 73.41,78.49 78.49,78.49 78.49,73.41 78.49,68.33 78.49,63.25 78.49,58.17 68.33,55.63 63.25,55.63 58.17,55.63 53.09,55.63 12.7,63.5 12.7,78.74 17.78,63.5 52.32,45.21 58.17,45.47 63.25,45.47 29.44,31.24 35.54,24.64 87.88,43.43 81.53,43.94
  pour Top: 66.04,48.51 66.04,33.78 67.31,32.51 102.11,32.51 102.11,44.7 81.03,44.7 81.03,48.51
  pour Top: 45.72,80.01 80.77,79.76 81.03,48.77 45.97,48.77
IR_DRAIN1  (via drill 0.45)
  Top 0.305: U$20.D v58.67,46.74
IR_SENS_ANLG_IN  (via drill 0.35, 0.45)
  Top 0.305: U$23.8 33.53,35.56 34.04,36.07 38.35,36.07 40.13,34.29 v40.64,34.29 | v52.07,31.24 53.91,31.24 R4.2
  Bottom 0.305: v52.07,31.24 50.29,33.02 50.29,33.78 49.78,34.29 v40.64,34.29
IR_SOURCE1  (via drill 0.45)
  Top 0.305: U$20.S 53.96,46.09 v53.85,45.97
IR_START0  (via drill 0.35, 0.45)
  Top 0.254: U$19.G 62.19,36.34
  Top 0.305: R7.1 60.25,36.34 U$19.G 62.14,36.99 62.48,37.34 63.5,37.34 64.01,37.85 v64.01,41.91 | U$23.38 35.03,44.73 35.56,44.2 38.1,44.2 38.86,44.96 38.86,46.23 40.64,48.01 46.23,48.01 46.99,47.24 46.99,44.7 47.5,44.2 v64.01,44.2
  Bottom 0.305: v64.01,41.91 v64.01,44.2
IR_START1  (via drill 0.45)
  Top 0.305: 55.44,47.39 U$20.G 54.01,47.34 v53.85,47.5 52.51,47.5 R8.1 | U$23.37 35.54,44.98 35.81,44.7 37.85,44.7 38.35,45.21 38.35,46.48 40.39,48.51 51.31,48.51 51.82,48.01 51.82,47.18 R8.1 | R8.1 51.82,46.8
IR_V
  Top 0.61: U$18.COLL 54.31,35.05 SJ11.1 52.32,35.56 52.32,40.64 SJ10.1 52.35,40.67 54.43,40.67 U$18.A
MTR_5V_EN1,2
  Top 0.305: U1.3 39.1,59.45 39.62,58.93 52.07,58.93 52.32,59.18 U$13.1
MTR_5V_EN3,4
  Top 0.305: 38.45,60.81 U1.4 38.45,59.33 39.62,58.17 55.63,58.17 56.13,58.67 56.13,62.23 58.93,65.02 69.6,65.02 70.1,65.53 U$13.9
MTR_A1
  Top 0.305: 33.58,45.9 U$23.41 33.53,47.88 37.15,51.51 U1.19
MTR_A2
  Top 0.305: U1.18 36.51,51.62 33.02,48.13 U$23.42
MTR_B1
  Top 0.305: 32.51,45.87 U$23.43 32.51,45.87 | U1.17 35.85,51.73 32.51,48.39 32.51,45.87
MTR_B2
  Top 0.305: U1.16 35.2,51.84 32,48.64 32,45.87 U$23.44
MTR_EN1,2
  Top 0.305: U$23.39 34.54,47.24 38.48,51.18 38.48,54.61 U1.21
MTR_EN3,4
  Top 0.305: U1.20 37.8,51.39 34.04,47.62 U$23.40
MTR_IN_A1
  Top 0.305: U1.5 37.8,59.22 39.37,57.66 67.06,57.66 67.56,58.17 U$13.7
MTR_IN_A2
  Top 0.305: U1.6 37.15,61.03 38.61,62.48 54.61,62.48 54.86,62.23 U$13.2
MTR_IN_B1
  Top 0.305: U1.7 36.51,61.03 38.42,62.94 38.56,62.94 38.61,62.99 56.13,62.99 58.67,65.53 67.06,65.53 67.56,66.04 U$13.10
MTR_IN_B2
  Top 0.305: U$13.15 54.86,64.01 54.36,63.5 38.1,63.5 35.81,61.21 35.81,60.21 U1.8
MTR_OUT_A1
  Top 0.61: U$13.6 65.02,62.23 65.53,62.74 71.37,62.74 73.91,65.02 73.91,71.88 70.55,74.74 U$14.P$4
MTR_OUT_A2
  Top 0.305: 57.4,60.96 U$13.3
  Top 0.61: U$13.3 57.4,62.23 59.44,64.26 70.61,64.26 72.14,65.53 72.14,70.87 71.63,71.37 67.06,71.37 66.04,72.39 U$14.P$3
MTR_OUT_B1
  Top 0.61: U$14.P$2 61.4,72.21 62.48,71.12 64.52,71.12 65.02,70.61 U$13.11
MTR_OUT_B2
  Top 0.61: U$13.14 57.4,72.39 56.9,72.9 U$14.P$1
N$1  (via drill 1 pad 1.6)
  Bottom 0.305: U$24.A0 v94.49,21.84
N$2  (1 unrouted)
N$3
  Top 0.305: 106.68,-7.62 109.22,-7.62
N$4  (via drill 1 pad 1.6)  (1 unrouted)
  Top 0.305: JP8.6 7.11,34.05 5.28,35.88 5.28,36.76 5.91,37.39 7.92,37.39 9.4,38.86 12.19,38.86 v13.46,40.13
N$5
  Top 0.305: U$18.CATH 58.7,42.12 59.94,42.15 60.45,41.59 R6.2
N$8  (1 unrouted)
N$9  (via drill 1 pad 1.6)
  Bottom 0.305: U$24.RSV v91.95,21.84
N$10
  Top 0.305: U$19.D 62.74,38.8 R6.1
N$13  (via drill 1 pad 1.6)
  Bottom 0.305: U$24.RSV@1 v89.41,21.84
N$14  (via drill 1 pad 1.6)
  Bottom 0.305: U$24.SD3 v86.87,21.84
N$15  (via drill 1 pad 1.6)
  Bottom 0.305: U$24.SD2 v84.33,21.84
N$16  (via drill 1 pad 1.6)
  Bottom 0.305: U$24.SD1 v81.79,21.84
N$23  (via drill 1 pad 1.6)
  Bottom 0.305: U$24.CMD 79.25,20.32 v79.76,19.81
N$24  (via drill 1 pad 1.6)
  Bottom 0.305: U$24.SD0 76.71,23.37 v75.18,21.84
N$25  (via drill 1 pad 1.6)
  Bottom 0.305: U$24.CLK 74.17,23.37 v72.64,21.84
N$26  (via drill 1 pad 1.6)
  Bottom 0.305: U$24.D2 v89.41,10.16
N$27  (via drill 1 pad 1.6)
  Bottom 0.305: U$24.D3 v86.87,10.16
N$28  (via drill 1 pad 1.6)
  Bottom 0.305: U$24.D4 v84.33,10.16
N$29  (via drill 1 pad 1.6)
  Bottom 0.305: U$24.RX v66.55,10.16
N$30  (via drill 1 pad 1.6)
  Bottom 0.305: U$24.TX v64.01,10.16
N$31  (via drill 1 pad 1.6)
  Bottom 0.305: U$24.EN 66.55,24.38 65.53,23.37 65.53,16.76 v66.55,15.75
N$32  (via drill 1 pad 1.6)
  Bottom 0.305: U$24.RST v64.01,15.75
N$33  (1 unrouted)
N$34
  Top 0.305: U$23.27 45.19,41.38 45.21,41.4
N$35  (via drill 0.35)
  Top 0.305: v31.24,39.88 31.75,40.39 U$23.25
  Bottom 0.305: 30.48,39.37 30.99,39.88 v31.24,39.88
N$36  (1 unrouted)
N$37  (1 unrouted)
N$38  (1 unrouted)
N$39  (1 unrouted)
N$40  (1 unrouted)
N$41  (1 unrouted)
N$42  (1 unrouted)
N$43  (1 unrouted)
N$44  (1 unrouted)
N$45
  Top 0.305: R5.2 61.28,33.72 59.65,35.35 U$18.E 55.81,34.01 R4.1
NFC0_SEL  (1 unrouted)
  Top 0.305: 16.76,61.72 13.72,59.69 13.72,47.24 18.08,42.88 U$23.51
NFC1_IRQ  (1 unrouted)
NFC1_SEL  (via drill 0.35)  (1 unrouted)
  Top 0.305: U$23.24 32.51,39.88 v31.5,38.86
NFC_IRQ_NFC0
  Top 0.305: U$23.50 18.59,43.38 17.02,44.96 17.02,60.2 13.43,63.78 13.43,63.8 13,64.23 12.98,64.23 15.49,66.8
NRST  (via drill 0.35)
  Top 0.254: 44.13,31.68 R11.2
  Top 0.305: U$23.7 33.02,35.81 v34.04,36.83 | v27.43,51.56 27.43,55.88 25.91,57.4 SWD1.5 | R11.2 43.43,31.94 43.43,33.02 42.93,33.53 42.52,33.53 42.16,33.89 42.16,35.31 v41.4,36.07
  Bottom 0.305: v41.4,36.07 40.13,37.34 37.34,37.34 36.83,36.83 v34.04,36.83 34.04,43.43 33.53,43.94 30.48,43.94 28.96,45.47 28.96,50.04 v27.43,51.56
OSC_IN  (2 unrouted)
OSC_OUT  (2 unrouted)
PRG_RX<  (via drill 0.35)
  Top 0.254: 28.12,38.94 U$23.59
  Top 0.305: U$23.59 27.2,38.89 27.18,38.86 24.64,38.86 v22.86,40.64
  Bottom 0.305: v22.86,40.64 22.86,43.94 PWG.1
PRG_TX>  (via drill 0.35)
  Top 0.305: U$23.58 25.4,39.37 v24.13,40.64
  Bottom 0.305: v24.13,40.64 24.13,45.21 PWG.2
SOCK__CS_DP
  Top 0.305: JP6.17 28.19,7.11 28.19,9.91 28.7,10.41 28.7,12.54 28.7,13.03 U$2.P$33
SOCK__RCLK
  Top 0.305: JP6.15 25.65,7.11 25.65,11.58 U$2.P$11
SOCK__SEL
  Top 0.305: U$1.P$44 11.87,9.71 12.75,8.82 12.75,6.91 JP6.3
SOCK_A0
  Top 0.305: JP6.10 19.3,9.14 18.22,10.23 U$3.P$44
SOCK_CLK
  Top 0.305: JP6.12 21.84,13.06 U$4.P$22
SOCK_NCS1
  Top 0.305: JP6.9 18.54,5.84 18.03,6.35 18.03,9.4 17.42,10.01 U$3.P$33
SOCK_NCS2
  Top 0.305: JP6.11 21.08,5.84 20.57,6.35 20.57,12.59 U$4.P$11
SOCK_NRD
  Top 0.305: U$3.P$11 15.82,13.01 15.7,12.89 15.7,7.94 16.76,6.87 JP6.7
SOCK_NRST
  Top 0.305: U$3.P$22 16.62,8.74 JP6.8
SOCK_NWR
  Top 0.305: JP6.13 24.38,6.6 23.11,7.87 23.11,11.94 22.86,12.19 22.86,13.06 U$4.P$33
SOCK_PWR_LED_B
  Top 0.305: U$7.P$33 42.56,9.49 43.23,8.82 43.23,6.91 JP6.27
SOCK_PWR_LED_G
  Top 0.305: JP6.25 40.96,7.18 U$7.P$11
SOCK_PWR_LED_R
  Top 0.305: JP6.23 35.81,7.11 35.81,9.65 35.38,10.09 U$6.P$11
SOCK_ROTA
  Top 0.305: U$1.P$11 9.47,8.71 JP6.2
SOCK_ROTB
  Top 0.305: JP6.4 11.07,9 U$1.P$33
SOCK_ROTSW
  Top 0.305: JP6.1 9.14,6.87 10.21,7.94 10.21,13.11 U$1.P$22
SOCK_SPI_CLK
  Top 0.305: JP6.16 26.92,9.91 27.94,10.92 27.94,13.06 U$2.P$22
SOCK_SPI_MOSI
  Top 0.305: JP6.18 29.65,8.57 U$2.P$44
SOCK_WIFI_LED_B
  Top 0.305: JP6.24 37.08,9.91 36.58,10.41 36.58,11.43 36.18,11.83 U$6.P$22
SOCK_WIFI_LED_G
  Top 0.305: U$6.P$33 37.12,13.03 37.12,12.54 37.73,11.94 38.86,11.94 39.62,11.18 JP6.26
SOCK_WIFI_LED_R
  Top 0.305: JP6.28 41.76,8.78 U$7.P$22
SPI2_CLK  (via drill 0.4)
  Top 0.305: U$22.CLK 36.83,75.44 42.16,75.44 43.18,74.42 v43.18,68.33 | v43.18,56.39 43.18,49.78 42.42,49.02 39.37,49.02 37.08,46.74 37.08,45.9 U$23.34
  Bottom 0.305: v43.18,68.33 v43.18,56.39
SPI2_MISO  (via drill 0.45)
  Top 0.305: U$23.35 36.52,47.19 39.37,50.04 v39.88,50.04 | v42.16,51.56 42.16,55.12 40.89,56.39 39.12,56.39 37.08,58.42 32.77,58.42 32.26,58.93 32.26,60.96 36.58,65.28 v36.58,66.29
  Bottom 0.305: v39.88,50.04 39.88,50.55 40.39,51.05 41.66,51.05 v42.16,51.56 | v36.58,66.29 36.58,68.58 38.1,70.1 U$22.DAT
SPI5_CLK
  Top 0.305: U$21.CLK 16.51,71.12 22.1,65.53 22.1,58.67 25.4,55.37 25.4,48.01 30.23,43.18 35.81,43.18 38.1,40.89 U$23.26
SPI5_MISO
  Top 0.305: U$23.45 31.52,65 28.7,67.82 22.61,67.82 19.05,71.38 U$21.DAT
SPI_CLK  (via drill 0.35)  (4 unrouted)
  Top 0.254: 76.71,3.3 75.82,2.16 73.66,2.16 72.9,2.79 72.9,12.19 66.75,18.34 52.39,18.34 46.99,23.74 46.99,37.59 46.2,38.38 U$23.21 34.06,38.38 31.75,36.07 30.35,36.07 29.21,34.8 29.21,34.54 27.69,33.02 26.16,33.02 25.53,32.39 25.53,31.24 24.13,31.24 23.88,30.99 v23.88,30.48
  Top 0.305: 7.37,23.62 14.22,30.48 v14.99,30.48 | v23.88,30.48 23.88,25.4 24.38,24.89 25.15,24.89 27.43,22.61 28.96,22.61 | U$24.D5 76.71,3.3
  Bottom 0.305: v14.99,30.48 v23.88,30.48
SPI_MISO  (via drill 0.35)  (2 unrouted)
  Top 0.254: U$23.22 36.21,38.86 33.53,38.86 31.24,36.58 30.23,36.58 27.69,34.04 26.16,34.04 v24.13,32
  Top 0.305: U$24.D6 74.17,12.19 67.31,19.3 52.58,19.3 47.75,24.13 47.75,37.59 46.48,38.86 39.52,38.86 U$23.22 | 7.62,26.16 13.46,32 v14.99,32
  Bottom 0.305: v14.99,32 v24.13,32
SPI_MOSI  (via drill 0.35)  (4 unrouted)
  Top 0.254: U$24.D7 71.63,2.54 72.39,1.65 76.96,1.65 77.98,2.54 77.98,9.65 67.82,20.32 52.72,20.32 48.51,24.52 48.51,37.59 46.74,39.37 U$23.23 33.02,39.37 30.73,37.08 30.1,37.08 28.07,35.05 26.16,35.05 v25.4,34.29
  Top 0.305: 7.87,28.7 13.46,34.29 v14.99,34.29 | 32,22.35 30.99,23.37 27.94,23.37 25.4,25.91 v25.4,30.48
  Bottom 0.305: v14.99,34.29 v25.4,34.29 v25.4,30.48
SWCLK
  Top 0.305: SWD1.2 18.29,60.2 24.64,53.85 24.64,45.47 26.21,43.89 U$23.49
SWDIO
  Top 0.305: U$23.46 31.04,63.96 29.21,65.79 24.38,65.79 23.37,64.77 SWD1.4
SWO  (via drill 0.35)
  Top 0.305: v26.42,41.66 27.18,40.89 U$23.55 | SWD1.6 29.97,62.23 29.97,52.32 26.67,49.02 26.67,47.75 27.69,46.74 v28.19,46.74
  Bottom 0.305: v26.42,41.66 26.42,44.96 v28.19,46.74
USB12V
  Top 0.813: D2.C 90.42,49.78
  Top 1.016: SJ5.2 SJ6.2 90.42,58.67 | SJ3.1 90.42,49.78 90.42,52.32 | 90.42,52.32 90.42,58.67 | 90.42,58.67 LM317.3 87.56,58.74 R1.2 | D1.A 90.42,52.32
USBGND  (via drill 0.35)
  Top 1.016: R2.1 88.71,74.17 C4.2
  other vias: 83.82,78.74 86.36,78.74 88.9,78.74 99.06,78.74 91.44,73.15 93.98,73.15 88.9,68.58 85.09,55.88 85.09,53.34 86.36,48.26 83.82,48.26 93.98,48.26 96.52,48.26 101.6,60.96 101.6,66.04 87.63,55.88 87.63,53.34
  pour Bottom: 81.53,80.01 100.84,80.01 104.65,61.21 105.66,45.21 105.66,44.96 81.53,45.21
  pour Top: 81.53,80.01 100.84,80.01 104.65,61.21 105.66,45.21 105.66,44.96 81.53,45.21
USBVBUS
  Top 0.813: C3.1 92.64,68.83 93.73,68.83 95.76,70.87 95.76,73.41 98.3,75.95 SJ12.1 | SJ13.1 SJ9.2 SJ8.2 97.03,60.2 SJ14.1
  Top 1.016: LM317.1 87.63,65.53 88.65,66.55 SJ6.1 SJ5.1 | D1.C 93.47,62.48 94.74,63.75 94.74,65.79 | 94.74,65.79 93.98,66.55 SJ5.1 | SJ5.1 C3.1 | SJ13.1 96.77,65.79 94.74,65.79
V3.3  (via drill 0.35, 0.45)  (4 unrouted)
  Top 0.305: U$23.13 36.04,35.28 36.32,35.56 37.85,35.56 39.37,34.04 39.37,33.53 39.62,33.27 39.62,32.95 C11.1 40.2,32.45 | U$24.V3.3 58.93,4.83 57.98,5.78 C14.1 56.39,7.62 v54.36,9.65 | U$23.64 27.48,36.37 v26.92,35.81 C1.1 | U$23.1 30.02,33.83 v29.21,33.02 | U$24.V3.3@1 81.79,7.62 81.47,7.94 C15.1 81.47,9.72 v70.36,21.08 | U$24.V3.3@2 69.09,25.72 69.6,25.21 | 69.6,25.21 C16.1 | 40.39,54.62 U1.24 | U1.24 U1.23 | JP6.5 12.19,3.81 8.64,3.81 7.11,5.33 7.11,12.19 8.13,13.21 8.13,18.29 7.11,19.3 JP8.1 | v69.6,23.37 69.6,25.21 | v54.36,23.37 54.36,25.4 | U1.24 40.4,53.58 41.15,52.83 v41.15,50.04 | SJ10.2 51.05,43.69 47.24,43.69 46.48,44.45 46.48,46.74 45.97,47.24 44.7,47.24 | U$21.VCC 15.24,72.9 15.24,64.26 SWD1.1 | 44.7,47.24 v41.4,47.24 40.64,47.24 39.37,45.97 39.37,44.02 U$23.32 38.52,43.89 38.35,43.72 35.02,43.72 34.29,44.45 30.6,44.45 30.02,45.02 U$23.48 30.02,46.94 29.72,47.24 29.21,47.24 29.02,47.43 C7.1 | 44.7,47.24 C8.1 | U$23.19 43.13,37.39 43.18,37.34 43.11,37.34 C6.1 | 42.42,31.31 R11.1
  Top 0.406: 41.66,31.68 41.79,31.05
  Top 0.61: U$15.VOUT 73.41,36.58 | 69.09,29.97 U$24.V3.3@2 | U$24.V3.3@2 65.02,33.53 65.02,43.18 | 65.02,43.18 72.14,43.18 73.41,41.91 | U$24.V3.3@2 69.09,27.69 66.8,25.4 54.36,25.4 53.34,25.4 v52.07,26.67 | v15.75,29.21 7.87,21.08 JP8.1 3.05,21.08 2.03,22.1 2.03,50.8 2.79,51.56 | 65.02,43.18 SJ10.2 | 2.79,51.56 JP7.1 | U$22.VCC 33.02,76.97 31.5,78.49 15.49,78.49 13.97,76.96 13.97,76.45 | 13.97,76.45 U$21.VCC | 13.97,76.45 10.41,76.45 7.62,73.66 5.27,73.66 1.78,70.17 1.78,52.58 2.79,51.56 | v43.18,26.67 43.18,27.69 41.66,28.96 41.66,31.68 R11.1 41.66,31.82 41.66,32.26 41.21,32.7 C11.1
  Top 0.813: U$15.VOUT 73.41,41.91 U$15.VOUTB C10.1
  Bottom 0.305: JP6.14 22.91,6.91 16.32,6.91 15.25,5.84 JP6.5 | v70.36,21.08 69.6,21.84 v69.6,23.37 | v54.36,9.65 v54.36,23.37 | v41.15,50.04 v41.4,47.24
  Bottom 0.61: v52.07,26.67 v43.18,26.67 | v26.92,35.81 26.92,32 | v15.75,29.21 25.4,29.21 v29.21,33.02
  other vias: 33.02,27.69
V5  (via drill 0.35, 0.45, 1)
  Top 0.152: 40.4,61.45 v40.39,61.47
  Top 0.305: v11.43,74.17 11.43,72.14 11.68,71.88 | v30.48,71.88 v30.48,74.17
  Top 0.61: 75.18,35.81 U$15.VIN 75.71,36.84 74.42,35.56 68.07,35.56 v66.55,34.04 | 83.06,35.81 83.06,27.43 v74.93,19.3 | JP8.9 9.4,41.4 v10.16,40.64 12.95,42.93 12.95,52.07 12.19,52.83 5.84,52.83 4.83,53.85 4.83,70.87 5.84,71.88 JP7.9 11.68,71.88 v13.97,71.88 | v30.48,71.88 34.04,71.88 34.29,72.14 34.29,75.69 34.8,76.2 50.55,76.2 52.32,74.42 U$13.16 52.32,65.28 51.56,64.52 v40.39,64.52 | SJ11.2 53.85,33.53 v54.1,33.27 | U$24.V5 56.96,29.46 C5.1 | U1.1 40.4,61.45 | JP6.30 44.7,9.4 47.24,11.94 v67.56,11.94
  Top 0.813: C9.1 80.26,35.81
  Top 1.016: 75.18,35.81 80.26,35.81 83.06,35.81 U$16.VO
  Bottom 0.61: v74.93,19.3 v67.56,11.94 | v10.16,40.64 10.16,25.4 11.43,24.13 24.89,24.13 26.16,22.86 26.16,19.05 29.97,16 32,13.46 JP6.20 JP6.21 36.32,4.06 45.47,4.06 46.48,5.08 46.48,6.86 44.96,8.38 JP6.30 | v13.97,71.88 v30.48,71.88 | v40.39,61.47 v40.39,64.52 | v66.55,34.04 64.52,32 60.96,32 60.45,31.5 58.93,31.5 | v54.1,33.27 56.39,33.27 58.42,31.5 58.93,31.5 | 58.93,31.5 U$24.V5
V12
  Top 0.305: 78.99,48.51 79.25,48.51
  Top 0.813: U$13.8 71.88,60.45 79.25,53.09 79.25,48.51 79.25,43.43 80.52,42.16 83.82,42.16 U$16.VI 88.71,40.89 | 88.71,40.89 C2.1 | SJ3.2 90.42,41.15 | J2.3 91.95,37.13 92.96,38.61 90.42,41.15 | 90.42,41.15 90.17,40.89 88.71,40.89
VADJ
  Top 0.813: 83.75,60.89 R1.1 | 84.14,61.21 84.07,61.28 | 85.85,70.87 85.85,71.12
  Top 1.016: R1.1 84.14,61.21 LM317.2 | D2.A 82.8,59.94 83.75,60.89 | 84.07,61.28 84.07,66.55 85.85,68.33 85.85,70.87 86.11,71.12 87.88,71.12 88.9,72.14 C4.1 | 85.85,71.12 85.34,71.63 R2.2
VBUS
  Top 0.813: JP2.4 JP2.2 100.08,73.66 SJ12.2
VBUS_A
  Top 1.016: JP1.4 98.3,48.51 96.01,50.8 SJ14.2
VCAP
  Top 0.305: U$23.30 40.84,42.88 41.66,43.69 42.35,43.69 C12.1
VCONN
  Top 1.016: SJ13.2 100.33,67.31 JP2.6
VCONNA
  Top 1.016: SJ9.1 103.12,63.25 103.63,62.48 103.63,46.48 103.12,45.97 JP1.1
VDD
  Top 0.813: JP1.12 98.55,58.93 SJ8.1
VLT_DIR  (via drill 0.35)
  Top 0.305: U$23.36 36.04,47.98 36.07,48.01 v39.37,51.31 | v39.37,61.72 39.67,61.27 39.67,60.25 U1.2
  Bottom 0.305: v39.37,51.31 v39.37,61.72
WIFI_CS
  Top 0.254: U$24.D8 69.09,3.56 71.25,1.14 78.61,1.14 80.52,2.79 80.52,8.89 68.33,21.34 52.83,21.34 49.02,25.15 49.02,41.15 48.29,41.89 U$23.28
  Top 0.305: U$24.D8 69.09,3.81
WIFI_GPIO  (via drill 1 pad 1.6)
  Bottom 0.305: U$24.D1 v91.95,10.16
WIFI_IRQ  (via drill 1 pad 1.6)
  Top 0.305: 39.47,42.42 U$23.29 48.54,42.39 49.53,41.4 49.53,25.65 52.83,22.35 70.36,22.35 83.06,9.65 83.06,2.79 83.82,2.03 93.98,2.03 94.49,2.54 U$24.D0
  Bottom 0.305: U$24.D0 v94.49,10.16

### Text on the board
tPlace: MTR_OUT_B2 | MTR_OUT_B1 | MTR_OUT_A2 | MTR_OUT_A1 | V5 | GND | NFC_IRQ_NFC0 | NFC_SEL_NFC0 | VDD_TARGET | SWCLK | GND | SWDIO | NRST | SWO | SPI_MOSI | SPI_MISO | SPI_CLK | V3.3 | V5 | GND | NFC_IRQ_NFC1 | NFC_SEL_NFC1 | SPI_MOSI | SPI_MISO | SPI_CLK | V3.3